# Altium schematic sheet Drvenkar_Dario.SchDoc
size A4
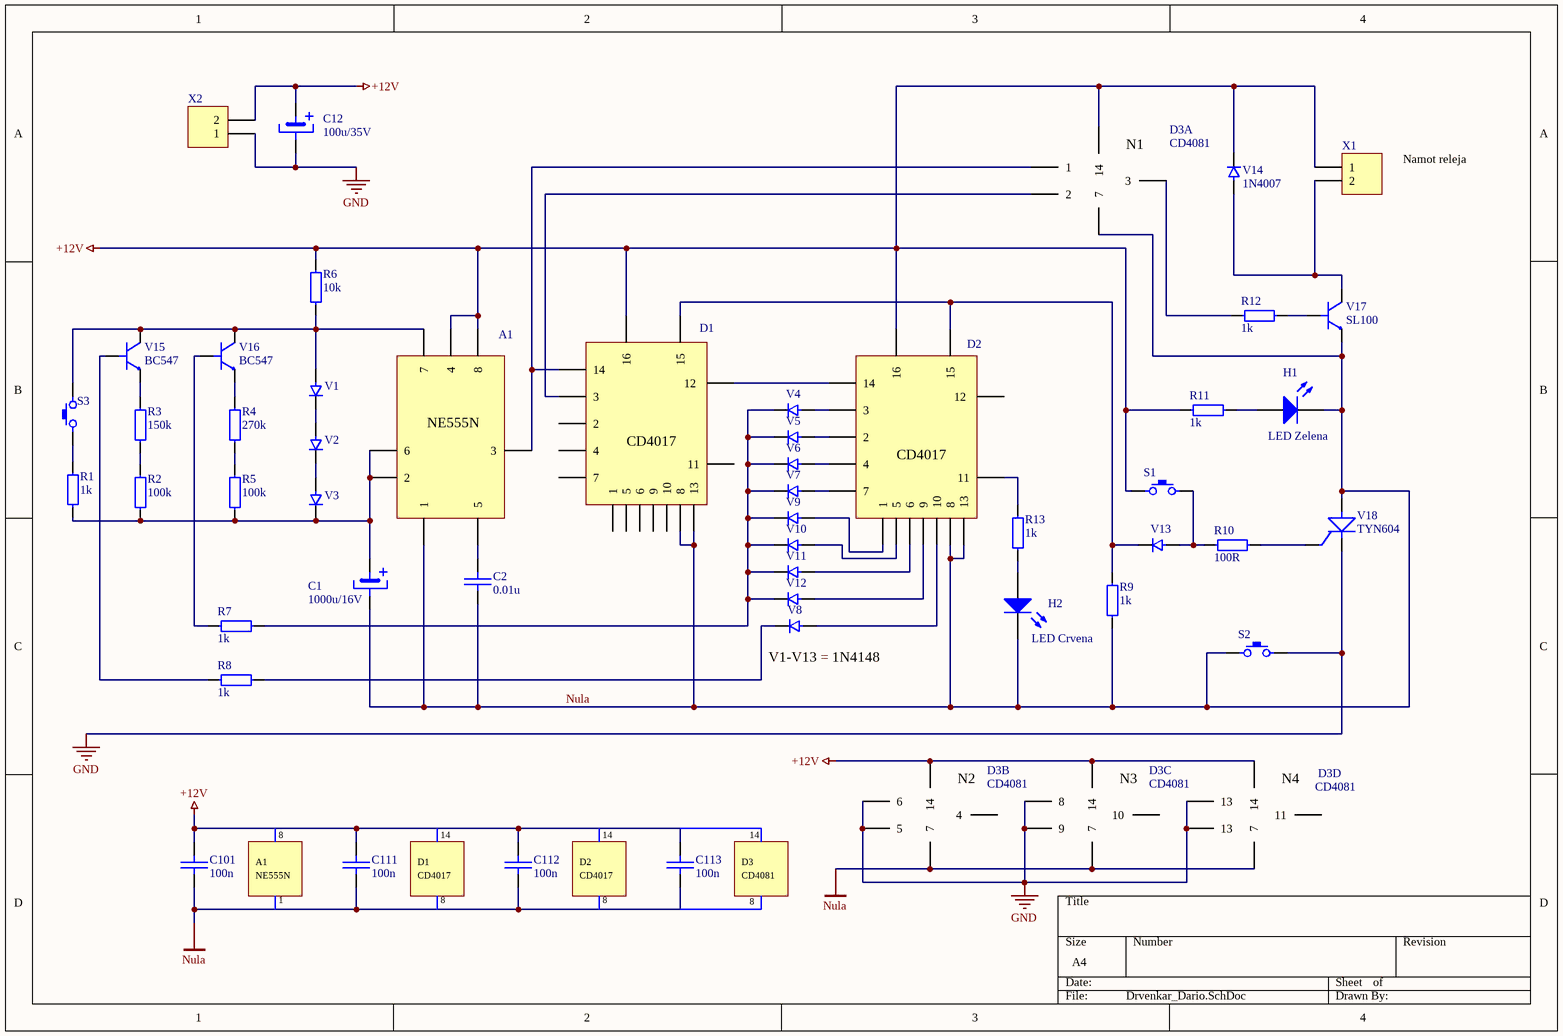
[diagram p0: Drvenkar_Dario.SchDoc]

## Parts
A1  NE555N  [DIP-8]  (value not drawn)
C1  1000u/16V  [ELKO-10x16]
C2  0.01u  [RAD-0.2]
C12  100u/35V  [ELKO-6.3x20]
C101  100n  [RAD-0.2]
C111  100n  [RAD-0.2]
C112  100n  [RAD-0.2]
C113  100n  [RAD-0.2]
D1  CD4017  [DIP-16]  (value not drawn)
D2  CD4017  [DIP-16]  (value not drawn)
D3  CD4081  [DIP-14]  (parts A,B,C,D of 4)
H1  LED Zelena  [LED dioda]
H2  LED Crvena  [LED dioda]
R1  1k  [AXIAL-0.4]
R2  100k  [AXIAL-0.4]
R3  150k  [AXIAL-0.4]
R4  270k  [AXIAL-0.4]
R5  100k  [AXIAL-0.4]
R6  10k  [AXIAL-0.4]
R7  1k  [AXIAL-0.4]
R8  1k  [AXIAL-0.4]
R9  1k  [AXIAL-0.4]
R10  100R  [AXIAL-0.4]
R11  1k  [AXIAL-0.4]
R12  1k  [AXIAL-0.4]
R13  1k  [AXIAL-0.4]
S1  Tipkalo  [Taster]  (value not drawn)
S2  Tipkalo  [Taster]  (value not drawn)
S3  Tipkalo  [Taster]  (value not drawn)
V1  1N4148  [DIODE-0.4]  (value not drawn)
V2  1N4148  [DIODE-0.4]  (value not drawn)
V3  1N4148  [DIODE-0.4]  (value not drawn)
V4  1N4148  [DIODE-0.4]  (value not drawn)
V5  1N4148  [DIODE-0.4]  (value not drawn)
V6  1N4148  [DIODE-0.4]  (value not drawn)
V7  1N4148  [DIODE-0.4]  (value not drawn)
V8  1N4148  [DIODE-0.4]  (value not drawn)
V9  1N4148  [DIODE-0.4]  (value not drawn)
V10  1N4148  [DIODE-0.4]  (value not drawn)
V11  1N4148  [DIODE-0.4]  (value not drawn)
V12  1N4148  [DIODE-0.4]  (value not drawn)
V13  1N4148  [DIODE-0.4]  (value not drawn)
V14  1N4007  [DIODE-0.4]
V15  BC547  [TO-92]
V16  BC547  [TO-92]
V17  SL100  [TO-92]
V18  TYN604  [TO-220-AB]
X1  2-pinski konektor  [Redna stezaljka]  (value not drawn)
X2  2-pinski konektor  [Redna stezaljka]  (value not drawn)

## Nets
+12V: A1.4 A1.8 C12.1 C101.1 C111.1 C112.1 C113.1 D1.16 D2.16 D3.14 R6.1 R11.1 S1.2 V14.2 X1.1 X2.2
GND: C12.2 D3.5 D3.6 D3.8 D3.9 D3.13 S2.1 V18.2 X2.1
Nula: A1.1 C1.2 C2.1 C101.2 C111.2 C112.2 C113.2 D1.8 D1.13 D2.8 D2.13 D3.7 H1.2(K) H2.2(K) R9.1 S2.2 V17.2 V18.1
NetA1_2: A1.2 A1.6 C1.1 R1.2 R2.2 R5.1 V3.2
NetA1_3: A1.3 D1.14 D3.1
NetA1_5: A1.5 C2.2
NetA1_7: A1.7 R6.2 S3.1 V1.1 V15.3 V16.3
NetD1_3: D1.3 D3.2
NetD1_12: D1.12 D2.14
NetD1_15: D1.15 D2.15 R9.2 V13.2
NetD2_1: D2.1 V9.1
NetD2_2: D2.2 V5.1
NetD2_3: D2.3 V4.1
NetD2_4: D2.4 V6.1
NetD2_5: D2.5 V10.1
NetD2_6: D2.6 V11.1
NetD2_7: D2.7 V7.1
NetD2_9: D2.9 V12.1
NetD2_10: D2.10 V8.1
NetD2_11: D2.11 R13.1
NetD3_3: D3.3 R12.1
NetH1_1: H1.1(A) R11.2
NetH2_1: H2.1(A) R13.2
NetR1_1: R1.1 S3.2
NetR2_1: R2.1 R3.2
NetR3_1: R3.1 V15.2
NetR4_1: R4.1 R5.2
NetR4_2: R4.2 V16.2
NetR7_1: R7.1 V16.1
NetR7_2: R7.2 V4.2 V5.2 V6.2 V7.2 V9.2 V10.2 V11.2 V12.2
NetR8_1: R8.1 V15.1
NetR8_2: R8.2 V8.2
NetR10_1: R10.1 S1.1 V13.1
NetR10_2: R10.2 V18.3
NetR12_2: R12.2 V17.1
NetV1_2: V1.2 V2.1
NetV2_2: V2.2 V3.1
NetV14_1: V14.1 V17.3 X1.2

Not connected (* = marked no-connect by the designer): D1 1 2 4 5 6 7 9 10 11; D2 12; D3 4 10 11

## Notes on the sheet
- Namot releja
- (near V8) V1-V13 = 1N4148
- (near D3) N4
- 8
- 14
- NE555N
- A1
- 1
- CD4017
- D1
- D2
- CD4081
- D3
- (in symbol CD4081, part A) N1
- (in symbol CD4081, part B) N2
- (in symbol CD4081, part C) N3

## Library data of the parts
A1 = NE555N: Cijena [kn]: 2.46; Kat. broj: X0005; Dobavljač: Kronos; Tip: NE555N
C1 = ELKO: Cijena [kn]: 2.48; Kat. broj: C2197; Dobavljač: Kronos; Tip: 1000u/16V
C2 = Kondenzator: Cijena [kn]: 2.25; Kat. broj: C0042; Dobavljač: Kronos; Tip: 0.01u
C12 = ELKO: Cijena [kn]: 0.95; Dobavljač: Kronos; Kat. broj: C2058; Tip: 100u/16V
C101 C111-C113 = Kondenzator: Cijena [kn]: 1.50; Kat. broj: C0045; Dobavljač: Kronos; Tip: 100n
D1 D2 = CD4017: Cijena [kn]: 3.30; Dobavljač: Kronos; Kat. broj: X8016; Tip: CD4017
D3 = CD4081: Cijena [kn]: 5.00; Dobavljač: Kronos; Kat. broj: X8049; Tip: CD4081
H1 = LED1: Typical RED GaAs LED; Cijena [kn]: 0.81; Kat. broj: D4040; Dobavljač: Kronos; Tip: LED Zelena
H2 = LED2: Typical RED, GREEN, YELLOW, AMBER GaAs LED; Cijena [kn]: 0.81; Kat. broj: D4039; Dobavljač: Kronos; Tip: LED Crvena
R1 R7-R9 R11-R13 = Otpornik: Cijena [kn]: 0.49; Kat. broj: RC032; Dobavljač: Kronos; Tip: 1k
R2 R5 = Otpornik: Cijena [kn]: 0.50; Kat. broj: RM055; Dobavljač: Kronos; Tip: 100k
R3 = Otpornik: Cijena [kn]: 0.25; Kat. broj: RC059; Dobavljač: Kronos; Tip: 150k
R4 = Otpornik: Cijena [kn]: 0.25; Kat. broj: RC064; Dobavljač: Kronos; Tip: 270k
R6 = Otpornik: Cijena [kn]: 0.50; Kat. broj: RM060; Dobavljač: Kronos; Tip: 10k
R10 = Otpornik: Cijena [kn]: 0.25; Kat. broj: RM065; Dobavljač: Kronos; Tip: 100R
S1-S3 = Tipkalo: Cijena [kn]: 2.55; Kat. broj: 2510014010; Tip: Diptronics DTS62K; Dobavljač: Chipoteka
V1-V13 = 1N4148: Cijena [kn]: 0.39; Kat. broj: D1009; Dobavljač: Kronos; Tip: 1N4148
V14 = 1N4007: Cijena [kn]: 0.39; Dobavljač: Kronos; Kat. broj: D1008; Tip: 1N4007
V15 V16 = Tranzistor: Cijena [kn]: 0.51; Kat. broj: T1045; Dobavljač: Kronos; Tip: BC547
V17 = Tranzistor: Cijena [kn]: 1.25; Kat. broj: T1082; Dobavljač: Farnell; Tip: SL100
V18 = Tiristor: Cijena [kn]: 9.26; Kat. broj: Y1020; Dobavljač: Kronos; Tip: TYN604
X1 = Header 2: Header, 2-Pin; Cijena [kn]: 2.50; Kat. broj: U8004; Dobavljač: Kronos; Tip: 2-pinski konektor
X2 = Header 2: Header, 2-Pin; Cijena [kn]: 2.50; Dobavljač: Kronos; Kat. broj: U8004; Tip: 2-pinski konektor